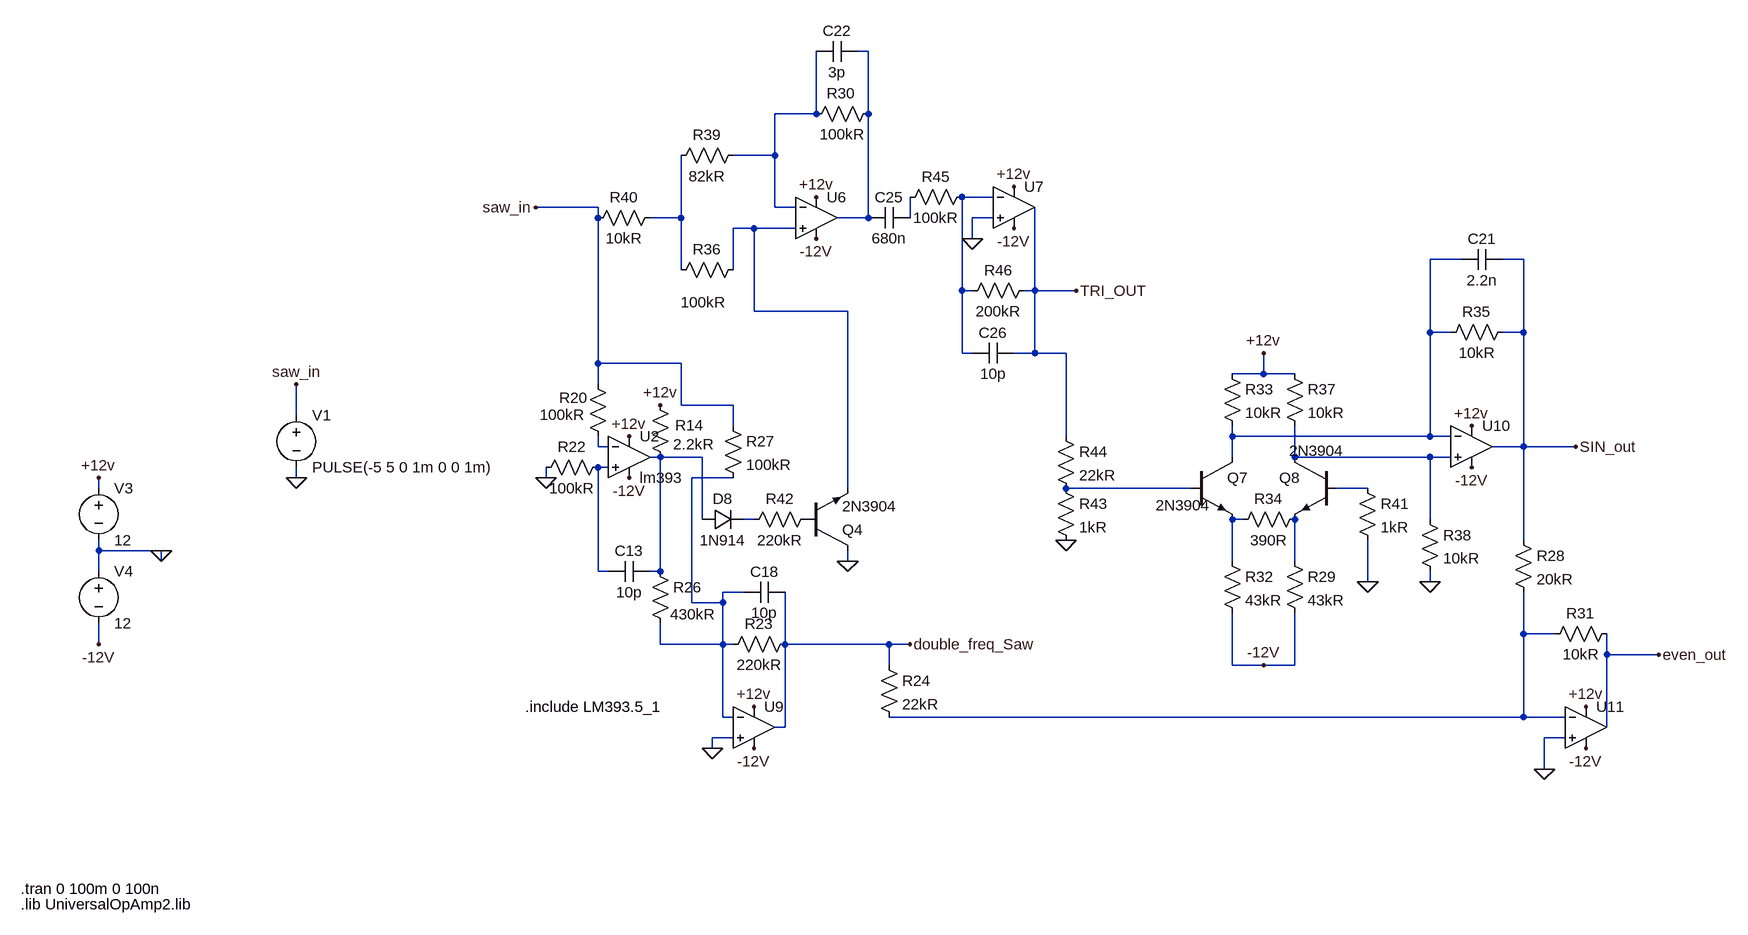
[diagram p0: schematic evenVCO_subcircuit_even.asc]
evenVCO_subcircuit_even.asc, the LTspice schematic file:
Version 4
SHEET 1 2480 1296
WIRE 1136 -32 1120 -32
WIRE 1056 64 1056 -32
WIRE 1056 64 992 64
WIRE 1136 64 1136 -32
WIRE 992 128 992 64
WIRE 992 128 928 128
WIRE 1328 192 1280 192
WIRE 720 208 624 208
WIRE 992 208 992 128
WIRE 1024 208 992 208
WIRE 720 224 720 208
WIRE 848 224 848 128
WIRE 848 224 800 224
WIRE 1136 224 1136 64
WIRE 1136 224 1088 224
WIRE 1200 224 1200 192
WIRE 1328 224 1296 224
WIRE 960 240 928 240
WIRE 1024 240 960 240
WIRE 1296 256 1296 224
WIRE 2048 288 2000 288
WIRE 2144 288 2112 288
WIRE 848 304 848 224
WIRE 928 304 928 240
WIRE 1280 336 1280 192
WIRE 1296 336 1280 336
WIRE 1392 336 1392 208
WIRE 1392 336 1376 336
WIRE 1456 336 1392 336
WIRE 960 368 960 240
WIRE 1104 368 960 368
WIRE 2000 400 2000 288
WIRE 2032 400 2000 400
WIRE 2144 400 2144 288
WIRE 2144 400 2112 400
WIRE 1280 432 1280 336
WIRE 1296 432 1280 432
WIRE 1392 432 1392 336
WIRE 1392 432 1360 432
WIRE 1440 432 1392 432
WIRE 720 448 720 224
WIRE 848 448 720 448
WIRE 1744 464 1744 432
WIRE 1744 464 1696 464
WIRE 1792 464 1744 464
WIRE 720 480 720 448
WIRE 848 512 848 448
WIRE 928 512 848 512
WIRE 256 528 256 480
WIRE 928 544 928 512
WIRE 1440 560 1440 432
WIRE 1696 560 1696 544
WIRE 2000 560 2000 400
WIRE 2000 560 1696 560
WIRE 2032 560 2000 560
WIRE 720 576 720 560
WIRE 736 576 720 576
WIRE 2144 576 2144 400
WIRE 2144 576 2096 576
WIRE 2224 576 2144 576
WIRE 816 592 800 592
WIRE 880 592 816 592
WIRE 1696 592 1696 560
WIRE 1792 592 1792 544
WIRE 2000 592 1792 592
WIRE 2032 592 2000 592
WIRE 736 608 720 608
WIRE 256 624 256 608
WIRE 640 624 640 608
WIRE 928 624 864 624
WIRE -48 640 -48 624
WIRE 1104 640 1104 368
WIRE 1632 640 1440 640
WIRE 1904 640 1856 640
WIRE 880 688 880 592
WIRE 960 688 944 688
WIRE 1712 688 1696 688
WIRE 2000 688 2000 592
WIRE 2144 720 2144 576
WIRE -48 736 -48 720
WIRE 48 736 -48 736
WIRE 48 752 48 736
WIRE 1104 752 1104 736
WIRE 1696 752 1696 688
WIRE 1792 752 1792 688
WIRE -48 768 -48 736
WIRE 720 768 720 608
WIRE 736 768 720 768
WIRE 816 768 816 592
WIRE 816 768 800 768
WIRE 1904 784 1904 720
WIRE 2000 784 2000 768
WIRE 944 800 912 800
WIRE 864 816 864 624
WIRE 912 816 912 800
WIRE 912 816 864 816
WIRE 2144 864 2144 800
WIRE 2192 864 2144 864
WIRE -48 880 -48 848
WIRE 816 880 816 848
WIRE 912 880 912 816
WIRE 912 880 816 880
WIRE 928 880 912 880
WIRE 1008 880 1008 800
WIRE 1168 880 1008 880
WIRE 1200 880 1168 880
WIRE 2272 896 2272 864
WIRE 2352 896 2272 896
WIRE 1168 912 1168 880
WIRE 1696 912 1696 832
WIRE 1744 912 1696 912
WIRE 1792 912 1792 832
WIRE 1792 912 1744 912
WIRE 912 992 912 880
WIRE 928 992 912 992
WIRE 2144 992 2144 864
WIRE 2144 992 1168 992
WIRE 2208 992 2144 992
WIRE 1008 1008 1008 880
WIRE 1008 1008 992 1008
WIRE 2272 1008 2272 896
WIRE 928 1024 896 1024
WIRE 2208 1024 2176 1024
WIRE 896 1040 896 1024
WIRE 2176 1072 2176 1024
FLAG 1456 336 TRI_OUT
FLAG 640 624 0
FLAG 816 512 +12v
FLAG 1104 752 0
FLAG 896 1040 0
FLAG 1200 880 double_freq_Saw
FLAG 1440 720 0
FLAG 1904 784 0
FLAG 1744 432 +12v
FLAG 1744 912 -12V
FLAG 2000 784 0
FLAG 2224 576 SIN_out
FLAG 2176 1072 0
FLAG 2352 896 even_out
FLAG 48 736 0
FLAG -48 624 +12v
FLAG -48 880 -12V
FLAG 624 208 saw_in
FLAG 1056 192 +12v
FLAG 1056 256 -12V
FLAG 2064 544 +12v
FLAG 2064 608 -12V
FLAG 2240 976 +12v
FLAG 2240 1040 -12V
FLAG 768 560 +12v
FLAG 768 624 -12V
FLAG 960 976 +12v
FLAG 960 1040 -12V
FLAG 256 624 0
FLAG 256 480 saw_in
FLAG 1296 256 0
FLAG 1360 176 +12v
FLAG 1360 240 -12V
SYMBOL res 816 208 R90
WINDOW 0 0 56 VBottom 2
WINDOW 3 32 56 VTop 2
SYMATTR InstName R40
SYMATTR Value 10kR
SYMBOL res 944 112 R90
WINDOW 0 0 56 VBottom 2
WINDOW 3 32 56 VTop 2
SYMATTR InstName R39
SYMATTR Value 82kR
SYMBOL res 944 288 R90
WINDOW 0 0 56 VBottom 2
WINDOW 3 50 62 VTop 2
SYMATTR InstName R36
SYMATTR Value 100kR
SYMBOL res 1152 48 R90
WINDOW 0 0 58 VBottom 2
WINDOW 3 32 56 VTop 2
SYMATTR InstName R30
SYMATTR Value 100kR
SYMBOL cap 1120 -48 R90
WINDOW 0 0 32 VBottom 2
WINDOW 3 32 32 VTop 2
SYMATTR InstName C22
SYMATTR Value 3p
SYMBOL cap 1200 208 R90
WINDOW 0 0 32 VBottom 2
WINDOW 3 32 32 VTop 2
SYMATTR InstName C25
SYMATTR Value 680n
SYMBOL res 1296 176 R90
WINDOW 0 0 56 VBottom 2
WINDOW 3 32 56 VTop 2
SYMATTR InstName R45
SYMATTR Value 100kR
SYMBOL res 1392 320 R90
WINDOW 0 0 56 VBottom 2
WINDOW 3 32 56 VTop 2
SYMATTR InstName R46
SYMATTR Value 200kR
SYMBOL cap 1360 416 R90
WINDOW 0 0 32 VBottom 2
WINDOW 3 32 32 VTop 2
SYMATTR InstName C26
SYMATTR Value 10p
SYMBOL res 736 592 R90
WINDOW 0 0 56 VBottom 2
WINDOW 3 32 56 VTop 2
SYMATTR InstName R22
SYMATTR Value 100kR
SYMBOL cap 800 752 R90
WINDOW 0 0 32 VBottom 2
WINDOW 3 32 32 VTop 2
SYMATTR InstName C13
SYMATTR Value 10p
SYMBOL res 704 464 R0
WINDOW 0 -44 37 Left 2
WINDOW 3 -74 63 Left 2
SYMATTR InstName R20
SYMATTR Value 100kR
SYMBOL res 800 496 R0
WINDOW 0 39 47 Left 2
SYMATTR InstName R14
SYMATTR Value 2.2kR
SYMBOL npn 1040 736 M180
SYMATTR InstName Q4
SYMATTR Value 2N3904
SYMBOL res 1056 672 R90
WINDOW 0 0 56 VBottom 2
WINDOW 3 32 56 VTop 2
SYMATTR InstName R42
SYMATTR Value 220kR
SYMBOL diode 880 704 R270
WINDOW 0 32 32 VTop 2
WINDOW 3 0 32 VBottom 2
SYMATTR InstName D8
SYMATTR Value 1N914
SYMBOL res 800 752 R0
WINDOW 3 31 82 Left 2
SYMATTR Value 430kR
SYMATTR InstName R26
SYMBOL res 1024 864 R90
WINDOW 0 0 56 VBottom 2
WINDOW 3 32 56 VTop 2
SYMATTR InstName R23
SYMATTR Value 220kR
SYMBOL cap 1008 784 R90
WINDOW 0 0 32 VBottom 2
WINDOW 3 32 32 VTop 2
SYMATTR InstName C18
SYMATTR Value 10p
SYMBOL res 912 528 R0
SYMATTR InstName R27
SYMATTR Value 100kR
SYMBOL res 1424 544 R0
SYMATTR InstName R44
SYMATTR Value 22kR
SYMBOL res 1424 624 R0
SYMATTR InstName R43
SYMATTR Value 1kR
SYMBOL npn 1632 592 R0
WINDOW 3 -54 74 Left 2
SYMATTR Value 2N3904
SYMATTR InstName Q7
SYMBOL npn 1856 592 M0
WINDOW 3 -12 -10 Left 2
SYMATTR Value 2N3904
SYMATTR InstName Q8
SYMBOL res 1680 448 R0
SYMATTR InstName R33
SYMATTR Value 10kR
SYMBOL res 1808 672 R90
WINDOW 0 0 56 VBottom 2
WINDOW 3 32 56 VTop 2
SYMATTR InstName R34
SYMATTR Value 390R
SYMBOL res 1776 448 R0
SYMATTR InstName R37
SYMATTR Value 10kR
SYMBOL res 1680 736 R0
SYMATTR InstName R32
SYMATTR Value 43kR
SYMBOL res 1776 736 R0
SYMATTR InstName R29
SYMATTR Value 43kR
SYMBOL res 1888 624 R0
SYMATTR InstName R41
SYMATTR Value 1kR
SYMBOL res 1984 672 R0
SYMATTR InstName R38
SYMATTR Value 10kR
SYMBOL res 2128 384 R90
WINDOW 0 0 56 VBottom 2
WINDOW 3 32 56 VTop 2
SYMATTR InstName R35
SYMATTR Value 10kR
SYMBOL cap 2112 272 R90
WINDOW 0 0 32 VBottom 2
WINDOW 3 32 32 VTop 2
SYMATTR InstName C21
SYMATTR Value 2.2n
SYMBOL res 1152 896 R0
SYMATTR InstName R24
SYMATTR Value 22kR
SYMBOL res 2128 704 R0
SYMATTR InstName R28
SYMATTR Value 20kR
SYMBOL res 2288 848 R90
WINDOW 0 0 56 VBottom 2
WINDOW 3 32 56 VTop 2
SYMATTR InstName R31
SYMATTR Value 10kR
SYMBOL voltage -48 624 R0
WINDOW 123 0 0 Left 0
WINDOW 39 0 0 Left 0
SYMATTR InstName V3
SYMATTR Value 12
SYMBOL voltage -48 752 R0
WINDOW 123 0 0 Left 0
WINDOW 39 0 0 Left 0
SYMATTR InstName V4
SYMATTR Value 12
SYMBOL OpAmps\\UniversalOpAmp2 1056 224 R0
SYMATTR InstName U6
SYMBOL OpAmps\\UniversalOpAmp2 960 1008 R0
SYMATTR InstName U9
SYMBOL OpAmps\\UniversalOpAmp2 2064 576 R0
SYMATTR InstName U10
SYMBOL OpAmps\\UniversalOpAmp2 2240 1008 R0
SYMATTR InstName U11
SYMBOL voltage 256 512 R0
WINDOW 123 0 0 Left 0
WINDOW 39 0 0 Left 0
SYMATTR InstName V1
SYMATTR Value PULSE(-5 5 0 1m 0 0 1m)
SYMBOL OpAmps\\UniversalOpAmp2 1360 208 R0
SYMATTR InstName U7
SYMBOL OpAmps\\opamp2 768 528 R0
SYMATTR InstName U2
SYMATTR Value lm393
TEXT -168 1256 Left 2 !.tran 0 100m 0 100n
TEXT -168 1280 Left 2 !.lib UniversalOpAmp2.lib
TEXT 608 976 Left 2 !.include LM393.5_1

The netlist it stands for:
* evenVCO_subcircuit_even.asc
R40 N004 saw_in 10kR
R39 N002 N004 82kR
R36 N006 N004 100kR
R30 N001 N002 100kR
C22 N001 N002 3p
C25 N005 N001 680n
R45 N003 N005 100kR
R46 TRI_OUT N003 200kR
C26 TRI_OUT N003 10p
R22 N011 0 100kR
C13 N009 N011 10p
R20 saw_in N008 100kR
R14 +12v N009 2.2kR
Q4 0 P001 N006 0 2N3904
R42 P001 N015 220kR
D8 N009 N015 1N914
R26 N009 N012 430kR
R23 double_freq_Saw N012 220kR
C18 double_freq_Saw N012 10p
R27 saw_in N012 100kR
R44 TRI_OUT N013 22kR
R43 N013 0 1kR
Q7 N007 N013 N016 0 2N3904
Q8 N010 N014 N017 0 2N3904
R33 +12v N007 10kR
R34 N017 N016 390R
R37 +12v N010 10kR
R32 N016 -12V 43kR
R29 N017 -12V 43kR
R41 N014 0 1kR
R38 N010 0 10kR
R35 SIN_out N007 10kR
C21 SIN_out N007 2.2n
R24 double_freq_Saw N018 22kR
R28 SIN_out N018 20kR
R31 even_out N018 10kR
V3 +12v 0 12
V4 0 -12V 12
XU6 N006 N002 +12v -12V N001 level2 Avol=1Meg GBW=10Meg Slew=10Meg Ilimit=25m Rail=0 Vos=0 En=0 Enk=0 In=0 Ink=0 Rin=500Meg  ; pins In+ In- V+ V- OUT
XU9 0 N012 +12v -12V double_freq_Saw level2 Avol=1Meg GBW=10Meg Slew=10Meg Ilimit=25m Rail=0 Vos=0 En=0 Enk=0 In=0 Ink=0 Rin=500Meg  ; pins In+ In- V+ V- OUT
XU10 N010 N007 +12v -12V SIN_out level2 Avol=1Meg GBW=10Meg Slew=10Meg Ilimit=25m Rail=0 Vos=0 En=0 Enk=0 In=0 Ink=0 Rin=500Meg  ; pins In+ In- V+ V- OUT
XU11 0 N018 +12v -12V even_out level2 Avol=1Meg GBW=10Meg Slew=10Meg Ilimit=25m Rail=0 Vos=0 En=0 Enk=0 In=0 Ink=0 Rin=500Meg  ; pins In+ In- V+ V- OUT
V1 saw_in 0 PULSE(-5 5 0 1m 0 0 1m)
XU7 0 N003 +12v -12V TRI_OUT level2 Avol=1Meg GBW=10Meg Slew=10Meg Ilimit=25m Rail=0 Vos=0 En=0 Enk=0 In=0 Ink=0 Rin=500Meg  ; pins In+ In- V+ V- OUT
XU2 N011 N008 +12v -12V N009 lm393  ; pins In+ In- V+ V- OUT
.model D D
.lib standard.dio
.model NPN NPN
.model PNP PNP
.lib standard.bjt
.tran 0 100m 0 100n
.lib UniversalOpAmp2.lib
.include LM393.5_1
.lib UniversalOpAmp2.lib
.backanno
.end